# Altium project LinoByte - Char - Project.PrjPCB
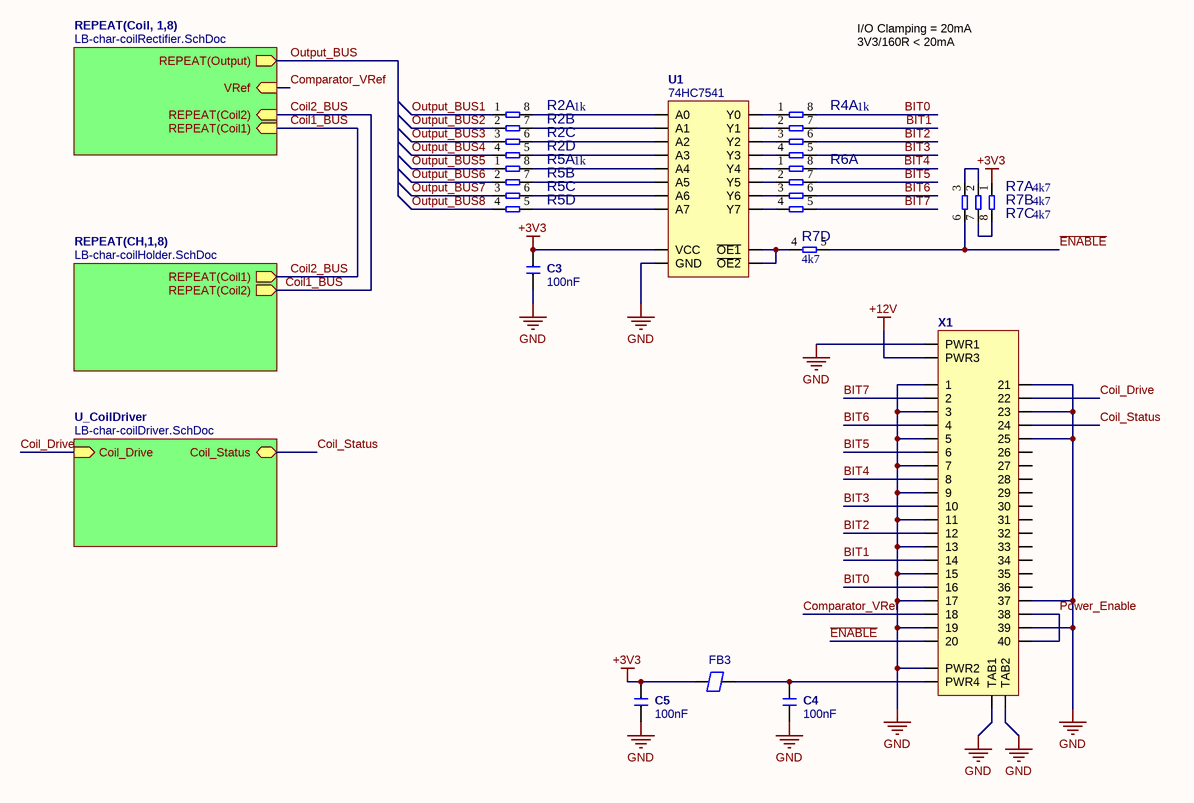
[diagram p0: LB-char-topLevel.SchDoc]
4 sheets, 224 parts. Net scope: hierarchical (ports join the sheet entries above them; power ports are global).
Board file: LinoByte - Char.PcbDoc
Sheets:
  LB-char-topLevel.SchDoc
    Coil1 = LB-char-coilRectifier.SchDoc
    Coil2 = LB-char-coilRectifier.SchDoc
    Coil3 = LB-char-coilRectifier.SchDoc
    Coil4 = LB-char-coilRectifier.SchDoc
    Coil5 = LB-char-coilRectifier.SchDoc
    Coil6 = LB-char-coilRectifier.SchDoc
    Coil7 = LB-char-coilRectifier.SchDoc
    Coil8 = LB-char-coilRectifier.SchDoc
    CH1 = LB-char-coilHolder.SchDoc
    CH2 = LB-char-coilHolder.SchDoc
    CH3 = LB-char-coilHolder.SchDoc
    CH4 = LB-char-coilHolder.SchDoc
    CH5 = LB-char-coilHolder.SchDoc
    CH6 = LB-char-coilHolder.SchDoc
    CH7 = LB-char-coilHolder.SchDoc
    CH8 = LB-char-coilHolder.SchDoc
    U_CoilDriver = LB-char-coilDriver.SchDoc

## Sheet LB-char-topLevel.SchDoc
size A4

### Parts
C3  100nF  [C0603_N]
C4  100nF  [C0603_N]
C5  100nF  [C0603_N]
FB3  FB  [F0603_N]  (value not drawn)
R2  value 1k  [YC164]  (parts A,B,C,D of 4)
R4  value 1k  [YC164]  (parts A,B,C,D of 4)
R5  (no value)  [YC164]  (parts A,B,C,D of 4)
R6  (no value)  [YC164]  (parts A,B,C,D of 4)
R7  value 4k7  [YC164]  (parts A,B,C,D of 4)
U1  74HC7541  [TSSOP20_N]
X1  FX23 Right Angle Receptacle  [FX23-40S-0.5SH]  (value not drawn)

### Sub-sheets
REPEAT(CH,1,8) = LB-char-coilHolder.SchDoc: REPEAT(Coil1) (out), REPEAT(Coil2) (out)
REPEAT(Coil, 1,8) = LB-char-coilRectifier.SchDoc: REPEAT(Output) (out), VRef (in), REPEAT(Coil1) (in), REPEAT(Coil2) (in)
U_CoilDriver = LB-char-coilDriver.SchDoc: Coil_Drive (in), Coil_Status (bidir)

### Nets
+3V3: C3.1 C5.1 FB3.2 R7.1 U1.20(VCC)
+12V: X1.PWR3
GND: C3.2 C4.2 C5.2 U1.10(GND) X1.1 X1.3 X1.5 X1.7 X1.9 X1.11 X1.13 X1.15 X1.17 X1.19 X1.21 X1.23 X1.25 X1.37 X1.39 X1.PWR1 X1.PWR2 X1.TAB1 X1.TAB2
BIT0: R4.8 X1.16
BIT1: R4.7 X1.14
BIT2: R4.6 X1.12
BIT3: R4.5 X1.10
BIT4: R6.8 X1.8
BIT5: R6.7 X1.6
BIT6: R6.6 X1.4
BIT7: R6.5 X1.2
Coil1_BUS: sheet REPEAT(Coil, 1,8)/REPEAT(Coil1), sheet REPEAT(CH,1,8)/REPEAT(Coil2)
Coil2_BUS: sheet REPEAT(Coil, 1,8)/REPEAT(Coil2), sheet REPEAT(CH,1,8)/REPEAT(Coil1)
Coil_Drive: X1.22 ; sheet U_CoilDriver/Coil_Drive
Coil_Status: X1.24 ; sheet U_CoilDriver/Coil_Status
Comparator_VRef: X1.18 ; sheet REPEAT(Coil, 1,8)/VRef
~{ENABLE}: R7.5 R7.6 X1.20
Output_BUS: sheet REPEAT(Coil, 1,8)/REPEAT(Output)
Output_BUS1: R2.1
Output_BUS2: R2.2
Output_BUS3: R2.3
Output_BUS4: R2.4
Output_BUS5: R5.1
Output_BUS6: R5.2
Output_BUS7: R5.3
Output_BUS8: R5.4
Power_Enable: X1.38 X1.40
NetC4_1: C4.1 FB3.1 X1.PWR4
NetR2_5: R2.5 U1.5(A3)
NetR2_6: R2.6 U1.4(A2)
NetR2_7: R2.7 U1.3(A1)
NetR2_8: R2.8 U1.2(A0)
NetR4_1: R4.1 U1.18(Y0)
NetR4_2: R4.2 U1.17(Y1)
NetR4_3: R4.3 U1.16(Y2)
NetR4_4: R4.4 U1.15(Y3)
NetR5_5: R5.5 U1.9(A7)
NetR5_6: R5.6 U1.8(A6)
NetR5_7: R5.7 U1.7(A5)
NetR5_8: R5.8 U1.6(A4)
NetR6_1: R6.1 U1.14(Y4)
NetR6_2: R6.2 U1.13(Y5)
NetR6_3: R6.3 U1.12(Y6)
NetR6_4: R6.4 U1.11(Y7)
NetR7_2: R7.2 R7.3
NetR7_4: R7.4 U1.1(~{OE1}) U1.19(~{OE2})
NetR7_7: R7.7 R7.8

Not connected (* = marked no-connect by the designer): X1 26 27 28 29 30 31 32 33 34 35 36

### Notes on the sheet
- I/O Clamping = 20mA
  3V3/160R < 20mA

### Library data of the parts
C3-C5 = Capacitor: Capacitor MLCC; Manufacturer: Yageo; Manufacturer Part Number: CC0603KRX7R9BB104; Tolerance (%): 10; Category: Capacitor; Package: 0603; Value: 100nF; Supplier Part Number 1: 1362556; Supplier 1: Farnell; ComponentLink1URL: http://www.yageo.com; ComponentLink1Description: Manufacturer Website; Voltage Rating (Volts): *; Supplier 2: Digi-Key; Supplier Part Number 2: 311-1344-1-ND
FB3 = Ferrite Bead
R2 R4 R7 = Resistor Array - 4P
R5 R6 = Resistor Array - 4P: Value: 1k
U1 = 74HC7541: Schmitt Trigger Octal
X1 = FX23-40S-0.5SH: FX23 Right Angle Receptacle 40 Pos

## Sheet LB-char-coilRectifier.SchDoc
size A4
Used 8 times, as channels Coil1, Coil2, Coil3, Coil4, Coil5, Coil6, Coil7, Coil8. Parts and nets are listed once, with the designators drawn on the sheet.
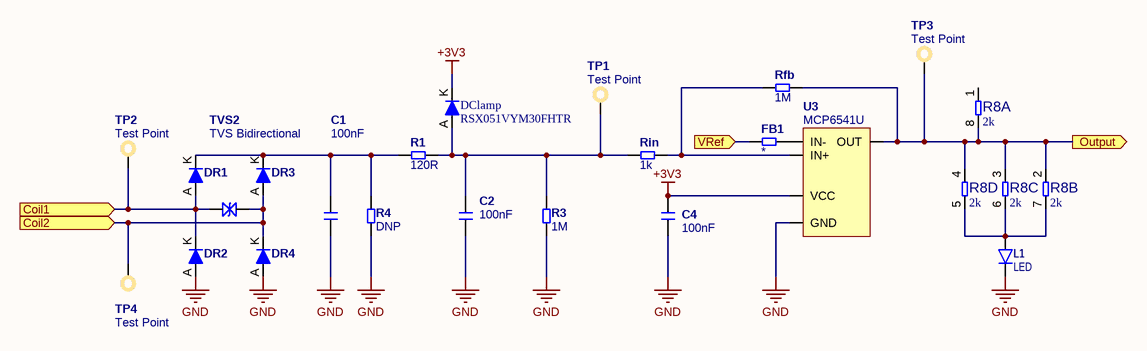
[diagram p1: LB-char-coilRectifier.SchDoc]

### Parts
C1  100nF  [C0603_N]
C2  100nF  [C0603_N]
C4  100nF  [C0603_N]
DClamp  RSX051VYM30FHTR  [SOD323F]
DR1  RSX051VYM30FHTR  [SOD323F]  (value not drawn)
DR2  RSX051VYM30FHTR  [SOD323F]  (value not drawn)
DR3  RSX051VYM30FHTR  [SOD323F]  (value not drawn)
DR4  RSX051VYM30FHTR  [SOD323F]  (value not drawn)
FB1  FB  [R0603]  (value not drawn)
L1  LED  [LED 0603/1608]
R1  120R  [R0603]
R3  1M  [R0603]
R4  DNP  [R0603]
R8  value 2k  [YC164]  (parts A,B,C,D of 4)
Rfb  1M  [R0603]
Rin  1k  [R0603]
TP1  Test Point  [Harwin S2751-46R]
TP2  Test Point  [Harwin S2751-46R]
TP3  Test Point  [Harwin S2751-46R]
TP4  Test Point  [Harwin S2751-46R]
TVS2  TVS Bidirectional  [SOD323F-Comchip Variant]
U3  MCP6541U  [SOT23-5_N]

### Ports
Coil1 (in), Coil2 (in), Output (out), VRef (in)

### Nets
+3V3: C4.1 DClamp.K U3.5(VCC)
GND: C1.2 C2.2 C4.2 DR2.A DR4.A L1.1(K) R3.1 R4.1 U3.2(GND)
Coil1: DR1.A DR2.K TP2.1 TVS2.2 ; port Coil1
Coil2: DR3.A DR4.K TP4.1 TVS2.1 ; port Coil2
Output: R8.2 R8.3 R8.4 R8.8 Rfb.2 TP3.1 U3.4(OUT) ; port Output
VRef: FB1.1 ; port VRef
NetC1_1: C1.1 DR1.K DR3.K R1.1 R4.2
NetC2_1: C2.1 DClamp.A R1.2 R3.2 Rin.1 TP1.1
NetFB1_2: FB1.2 U3.3(IN-)
NetL1_2: L1.2(A) R8.5 R8.6 R8.7
NetRfb_1: Rfb.1 Rin.2 U3.1(IN+)

Not connected (* = marked no-connect by the designer): R8 1

### Channels
Coil1: designators end in _Coil1; ports Coil1=Coil1_BUS1 Coil2=Coil2_BUS1 Output=Output_BUS1 VRef=Comparator_VRef
Coil2: designators end in _Coil2; ports Coil1=Coil1_BUS2 Coil2=Coil2_BUS2 Output=Output_BUS2 VRef=Comparator_VRef
Coil3: designators end in _Coil3; ports Coil1=Coil1_BUS3 Coil2=Coil2_BUS3 Output=Output_BUS3 VRef=Comparator_VRef
Coil4: designators end in _Coil4; ports Coil1=Coil1_BUS4 Coil2=Coil2_BUS4 Output=Output_BUS4 VRef=Comparator_VRef
Coil5: designators end in _Coil5; ports Coil1=Coil1_BUS5 Coil2=Coil2_BUS5 Output=Output_BUS5 VRef=Comparator_VRef
Coil6: designators end in _Coil6; ports Coil1=Coil1_BUS6 Coil2=Coil2_BUS6 Output=Output_BUS6 VRef=Comparator_VRef
Coil7: designators end in _Coil7; ports Coil1=Coil1_BUS7 Coil2=Coil2_BUS7 Output=Output_BUS7 VRef=Comparator_VRef
Coil8: designators end in _Coil8; ports Coil1=Coil1_BUS8 Coil2=Coil2_BUS8 Output=Output_BUS8 VRef=Comparator_VRef

### Library data of the parts
C1 C2 C4 = Capacitor: as C3 on sheet LB-char-topLevel; Category: Capacitor; Package: 0603; Value: 100nF; Supplier Part Number 1: 1362556; Supplier 1: Farnell; ComponentLink1URL: http://www.yageo.com; ComponentLink1Description: Manufacturer Website; Voltage Rating (Volts): *; Supplier 2: Digi-Key; Supplier Part Number 2: 311-1344-1-ND
DClamp DR1-DR4 = Diode
FB1 R1 R3 R4 Rfb Rin = Resistor: Published: 17-Dec-2003; LatestRevisionDate: 19-Mar-2004; LatestRevisionNote: Silkscreen size reduced.; PackageDocument: Mar-2003; PackageReference: 3-0603; Publisher: Altium Limited; Code_IPC: 1608 [0603]; ComponentLink1Description: Manufacturer Link; ComponentLink1URL: http://www.panasonic.com/industrial/components/resistive_products.htm; ComponentLink2Description: Datasheet; ComponentLink2URL: http://www.panasonic.com/industrial/components/pdf/AOA0000CE2.pdf
  FB1: Value: *
  R1: Value: 120R
  R3 Rfb: Value: 1M
  R4: Value: DNP
  Rin: Value: 1k
R8 = Resistor Array - 4P

## Sheet LB-char-coilHolder.SchDoc
size A
Used 8 times, as channels CH1, CH2, CH3, CH4, CH5, CH6, CH7, CH8. Parts and nets are listed once, with the designators drawn on the sheet.
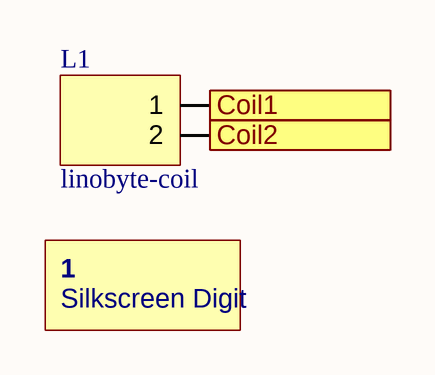
[diagram p2: LB-char-coilHolder.SchDoc]

### Parts
1  Silkscreen Digit  [PCB-7Seg-10mm]
L1  linobyte-coil  [linobyte-coil]

### Ports
Coil1 (out), Coil2 (out)

### Nets
Coil1: L1.1 ; port Coil1
Coil2: L1.2 ; port Coil2

### Channels
CH1: designators end in _CH1; ports Coil1=Coil2_BUS1 Coil2=Coil1_BUS1
CH2: designators end in _CH2; ports Coil1=Coil2_BUS2 Coil2=Coil1_BUS2
CH3: designators end in _CH3; ports Coil1=Coil2_BUS3 Coil2=Coil1_BUS3
CH4: designators end in _CH4; ports Coil1=Coil2_BUS4 Coil2=Coil1_BUS4
CH5: designators end in _CH5; ports Coil1=Coil2_BUS5 Coil2=Coil1_BUS5
CH6: designators end in _CH6; ports Coil1=Coil2_BUS6 Coil2=Coil1_BUS6
CH7: designators end in _CH7; ports Coil1=Coil2_BUS7 Coil2=Coil1_BUS7
CH8: designators end in _CH8; ports Coil1=Coil2_BUS8 Coil2=Coil1_BUS8

### Library data of the parts
1 = PCB-7Seg

## Sheet LB-char-coilDriver.SchDoc
size A4
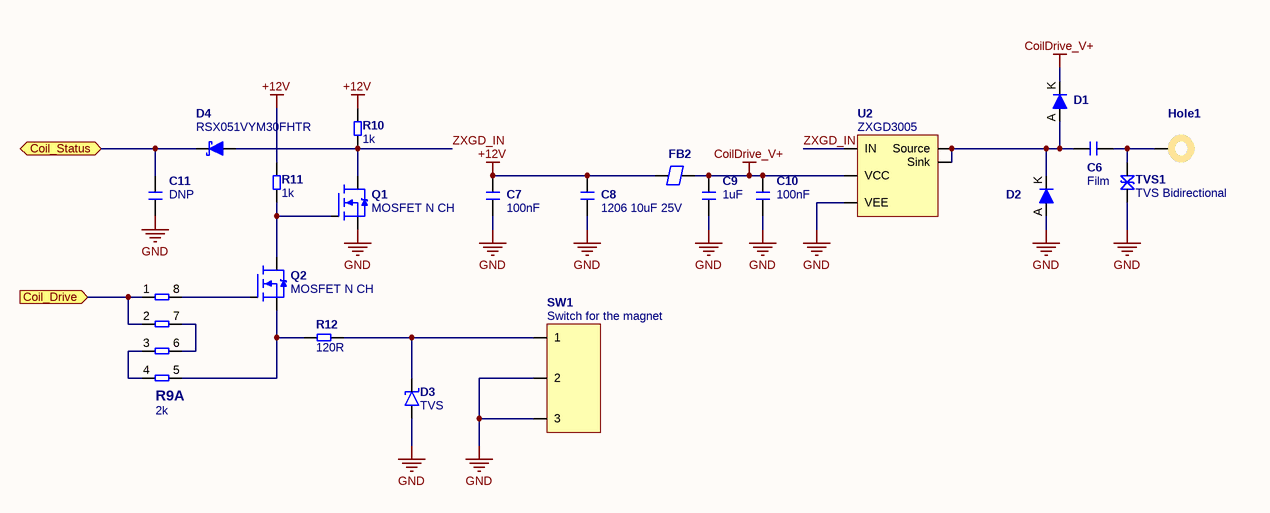
[diagram p3: LB-char-coilDriver.SchDoc]

### Parts
C6  Film  [Cap Film 5mm pitch, 7.2x7.2mm]
C7  100nF  [C0603_N]
C8  1206 10uF 25V  [C1206_N]
C9  1uF  [C0603_N]
C10  100nF  [C0603_N]
C11  DNP  [C0603_N]
D1  RSX051VYM30FHTR  [SOD323F]  (value not drawn)
D2  RSX051VYM30FHTR  [SOD323F]  (value not drawn)
D3  TVS  [SOD323F-Comchip Variant]
D4  RSX051VYM30FHTR  [SOD323F]
FB2  Ferrite Bead  [F0603_N]  (value not drawn)
Hole1  Hole  [Insert-Thread-SMD-M2]  (value not drawn)
Q1  MOSFET N CH  [SOT23_N]
Q2  MOSFET N CH  [SOT23_N]
R9  value 2k  [YC164]  (parts A,B,C,D of 4)
R10  1k  [R0603]
R11  1k  [R0603]
R12  120R  [R0603]
SW1  Switch for the magnet  [Linobyte - MagnetSwitch]
TVS1  TVS Bidirectional  [DO214AC SMA]
U2  ZXGD3005  [SOT23-6_N]

### Ports
Coil_Drive (in), Coil_Status (bidir)

### Nets
+12V: C7.1 C8.1 FB2.2 R10.2 R11.2
CoilDrive_V+: C9.1 C10.1 D1.K FB2.1 U2.1(VCC)
GND: C7.2 C8.2 C9.2 C10.2 C11.2 D2.A D3.1 Q1.3(S) SW1.2 SW1.3 TVS1.2 U2.3(VEE)
Coil_Drive: R9.1 R9.2 ; port Coil_Drive
Coil_Status: C11.1 D4.K ; port Coil_Status
ZXGD_IN: D4.A Q1.2(D) R10.1 U2.2(IN)
NetC6_1: C6.1 Hole1.1 TVS1.1
NetC6_2: C6.2 D1.A D2.K U2.4(Sink) U2.6(Source)
NetD3_2: D3.2 R12.2 SW1.1
NetQ1_1: Q1.1(G) Q2.2(D) R11.1
NetQ2_1: Q2.1(G) R9.8
NetQ2_3: Q2.3(S) R9.5 R12.1
NetR9_3: R9.3 R9.4
NetR9_6: R9.6 R9.7

### Library data of the parts
C6 = Capacitor - Film
C7-C11 = Capacitor: as C3 on sheet LB-char-topLevel; Category: Capacitor; Package: 0603; Supplier Part Number 1: 1362556; Supplier 1: Farnell; ComponentLink1URL: http://www.yageo.com; ComponentLink1Description: Manufacturer Website; Voltage Rating (Volts): *; Supplier 2: Digi-Key; Supplier Part Number 2: 311-1344-1-ND
  C7 C10: Value: 100nF
  C8 C9: Value: *
  C11: Value: DNP
D1 D2 = Diode
D4 = Diode Schottky
R9 = Resistor Array - 4P
R10-R12 = Resistor: Published: 17-Dec-2003; LatestRevisionDate: 19-Mar-2004; LatestRevisionNote: Silkscreen size reduced.; PackageDocument: Mar-2003; PackageReference: 3-0603; Publisher: Altium Limited; Code_IPC: 1608 [0603]; ComponentLink1Description: Manufacturer Link; ComponentLink1URL: http://www.panasonic.com/industrial/components/resistive_products.htm; ComponentLink2Description: Datasheet; ComponentLink2URL: http://www.panasonic.com/industrial/components/pdf/AOA0000CE2.pdf
  R10 R11: Value: 1k
  R12: Value: 120R
SW1 = Linobyte - MagnetSwitch

## Nets that join several sheets
+3V3: LB-char-topLevel (5 pins), Coil1 (C4_Coil1.1 DClamp_Coil1.K U3_Coil1.5), Coil2 (C4_Coil2.1 DClamp_Coil2.K U3_Coil2.5), Coil3 (C4_Coil3.1 DClamp_Coil3.K U3_Coil3.5), Coil4 (C4_Coil4.1 DClamp_Coil4.K U3_Coil4.5), Coil5 (C4_Coil5.1 DClamp_Coil5.K U3_Coil5.5), Coil6 (C4_Coil6.1 DClamp_Coil6.K U3_Coil6.5), Coil7 (C4_Coil7.1 DClamp_Coil7.K U3_Coil7.5), Coil8 (C4_Coil8.1 DClamp_Coil8.K U3_Coil8.5)
+12V: LB-char-topLevel (X1.PWR3), LB-char-coilDriver (5 pins)
GND: LB-char-topLevel (23 pins), Coil1 (9 pins), Coil2 (9 pins), Coil3 (9 pins), Coil4 (9 pins), Coil5 (9 pins), Coil6 (9 pins), Coil7 (9 pins), Coil8 (9 pins), LB-char-coilDriver (12 pins)
Coil1_BUS1: Coil1 (DR1_Coil1.A DR2_Coil1.K TP2_Coil1.1 TVS2_Coil1.2), CH1 (L1_CH1.2)
Coil1_BUS2: Coil2 (DR1_Coil2.A DR2_Coil2.K TP2_Coil2.1 TVS2_Coil2.2), CH2 (L1_CH2.2)
Coil1_BUS3: Coil3 (DR1_Coil3.A DR2_Coil3.K TP2_Coil3.1 TVS2_Coil3.2), CH3 (L1_CH3.2)
Coil1_BUS4: Coil4 (DR1_Coil4.A DR2_Coil4.K TP2_Coil4.1 TVS2_Coil4.2), CH4 (L1_CH4.2)
Coil1_BUS5: Coil5 (DR1_Coil5.A DR2_Coil5.K TP2_Coil5.1 TVS2_Coil5.2), CH5 (L1_CH5.2)
Coil1_BUS6: Coil6 (DR1_Coil6.A DR2_Coil6.K TP2_Coil6.1 TVS2_Coil6.2), CH6 (L1_CH6.2)
Coil1_BUS7: Coil7 (DR1_Coil7.A DR2_Coil7.K TP2_Coil7.1 TVS2_Coil7.2), CH7 (L1_CH7.2)
Coil1_BUS8: Coil8 (DR1_Coil8.A DR2_Coil8.K TP2_Coil8.1 TVS2_Coil8.2), CH8 (L1_CH8.2)
Coil2_BUS1: Coil1 (DR3_Coil1.A DR4_Coil1.K TP4_Coil1.1 TVS2_Coil1.1), CH1 (L1_CH1.1)
Coil2_BUS2: Coil2 (DR3_Coil2.A DR4_Coil2.K TP4_Coil2.1 TVS2_Coil2.1), CH2 (L1_CH2.1)
Coil2_BUS3: Coil3 (DR3_Coil3.A DR4_Coil3.K TP4_Coil3.1 TVS2_Coil3.1), CH3 (L1_CH3.1)
Coil2_BUS4: Coil4 (DR3_Coil4.A DR4_Coil4.K TP4_Coil4.1 TVS2_Coil4.1), CH4 (L1_CH4.1)
Coil2_BUS5: Coil5 (DR3_Coil5.A DR4_Coil5.K TP4_Coil5.1 TVS2_Coil5.1), CH5 (L1_CH5.1)
Coil2_BUS6: Coil6 (DR3_Coil6.A DR4_Coil6.K TP4_Coil6.1 TVS2_Coil6.1), CH6 (L1_CH6.1)
Coil2_BUS7: Coil7 (DR3_Coil7.A DR4_Coil7.K TP4_Coil7.1 TVS2_Coil7.1), CH7 (L1_CH7.1)
Coil2_BUS8: Coil8 (DR3_Coil8.A DR4_Coil8.K TP4_Coil8.1 TVS2_Coil8.1), CH8 (L1_CH8.1)
Coil_Drive: LB-char-topLevel (X1.22), LB-char-coilDriver (R9.1 R9.2)
Coil_Status: LB-char-topLevel (X1.24), LB-char-coilDriver (C11.1 D4.K)
Comparator_VRef: LB-char-topLevel (X1.18), Coil1 (FB1_Coil1.1), Coil2 (FB1_Coil2.1), Coil3 (FB1_Coil3.1), Coil4 (FB1_Coil4.1), Coil5 (FB1_Coil5.1), Coil6 (FB1_Coil6.1), Coil7 (FB1_Coil7.1), Coil8 (FB1_Coil8.1)
Output_BUS1: LB-char-topLevel (R2.1), Coil1 (7 pins)
Output_BUS2: LB-char-topLevel (R2.2), Coil2 (7 pins)
Output_BUS3: LB-char-topLevel (R2.3), Coil3 (7 pins)
Output_BUS4: LB-char-topLevel (R2.4), Coil4 (7 pins)
Output_BUS5: LB-char-topLevel (R5.1), Coil5 (7 pins)
Output_BUS6: LB-char-topLevel (R5.2), Coil6 (7 pins)
Output_BUS7: LB-char-topLevel (R5.3), Coil7 (7 pins)
Output_BUS8: LB-char-topLevel (R5.4), Coil8 (7 pins)